# EAGLE design CNY70 (EAGLE 8.1.0)
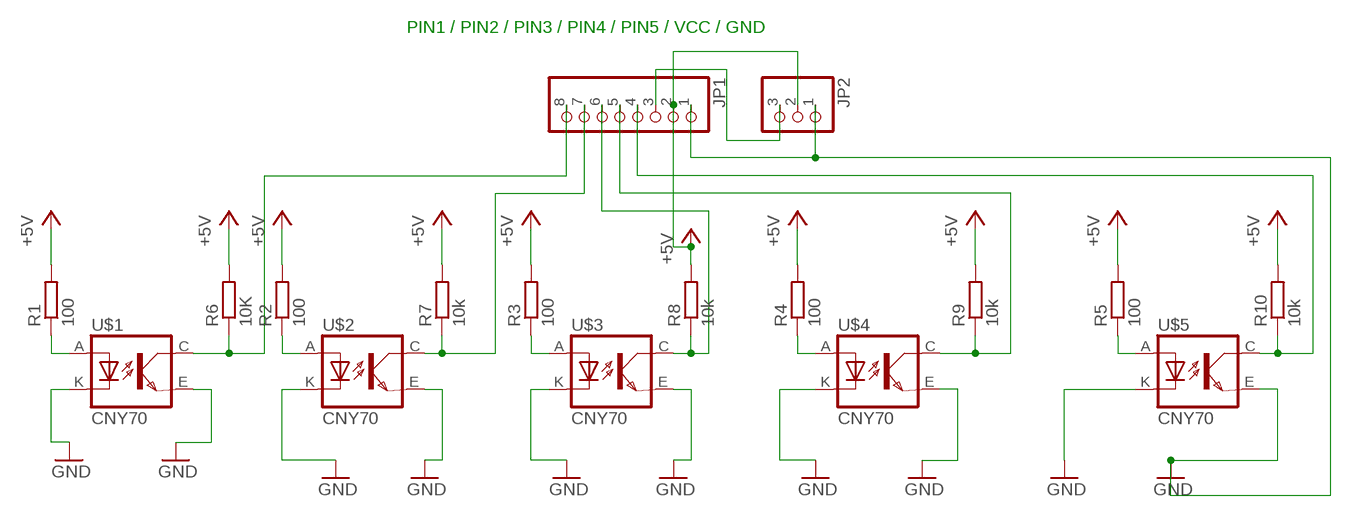
[diagram p0: schematic, sheet 1]

## Parts
JP1  PINHD-1X8  [1X08]
JP2  PINHD-1X3  [1X03]
R1  100  R-EU_0309/12  [0309/12]
R2  100  R-EU_0309/12  [0309/12]
R3  100  R-EU_0309/12  [0309/12]
R4  100  R-EU_0309/12  [0309/12]
R5  100  R-EU_0309/12  [0309/12]
R6  10K  R-EU_0309/12  [0309/12]
R7  10k  R-EU_0309/12  [0309/12]
R8  10k  R-EU_0309/12  [0309/12]
R9  10k  R-EU_0309/12  [0309/12]
R10  10k  R-EU_0309/12  [0309/12]
U$1  CNY70  [4]
U$2  CNY70  [4]
U$3  CNY70  [4]
U$4  CNY70  [4]
U$5  CNY70  [4]

## Nets
+5V: JP1.2 JP2.2 R1.2 R2.2 R3.2 R4.2 R5.2 R6.2 R7.2 R8.2 R9.2 R10.2
GND: JP1.1 JP2.1 U$1.E(EMI) U$1.K(C) U$2.E(EMI) U$2.K(C) U$3.E(EMI) U$3.K(C) U$4.E(EMI) U$4.K(C) U$5.E(EMI) U$5.K(C)
N$1: R1.1 U$1.A
N$2: R2.1 U$2.A
N$3: R3.1 U$3.A
N$4: R4.1 U$4.A
N$5: R5.1 U$5.A
N$6: JP1.8 R6.1 U$1.C(COL)
N$7: JP1.7 R7.1 U$2.C(COL)
N$8: JP1.6 R8.1 U$3.C(COL)
N$9: JP1.3 JP2.3
N$10: JP1.4 R10.1 U$5.C(COL)
N$12: JP1.5 R9.1 U$4.C(COL)

## Notes on the sheet
- PIN1 / PIN2 / PIN3 / PIN4 / PIN5 / VCC / GND

## Library data of the parts
JP1 = pinhead:PINHD-1X8: PIN HEADER
JP2 = pinhead:PINHD-1X3: PIN HEADER
R1-R10 = rcl:R-EU_: RESISTOR, European symbol
U$1-U$5 = cny70:CNY70

## Board
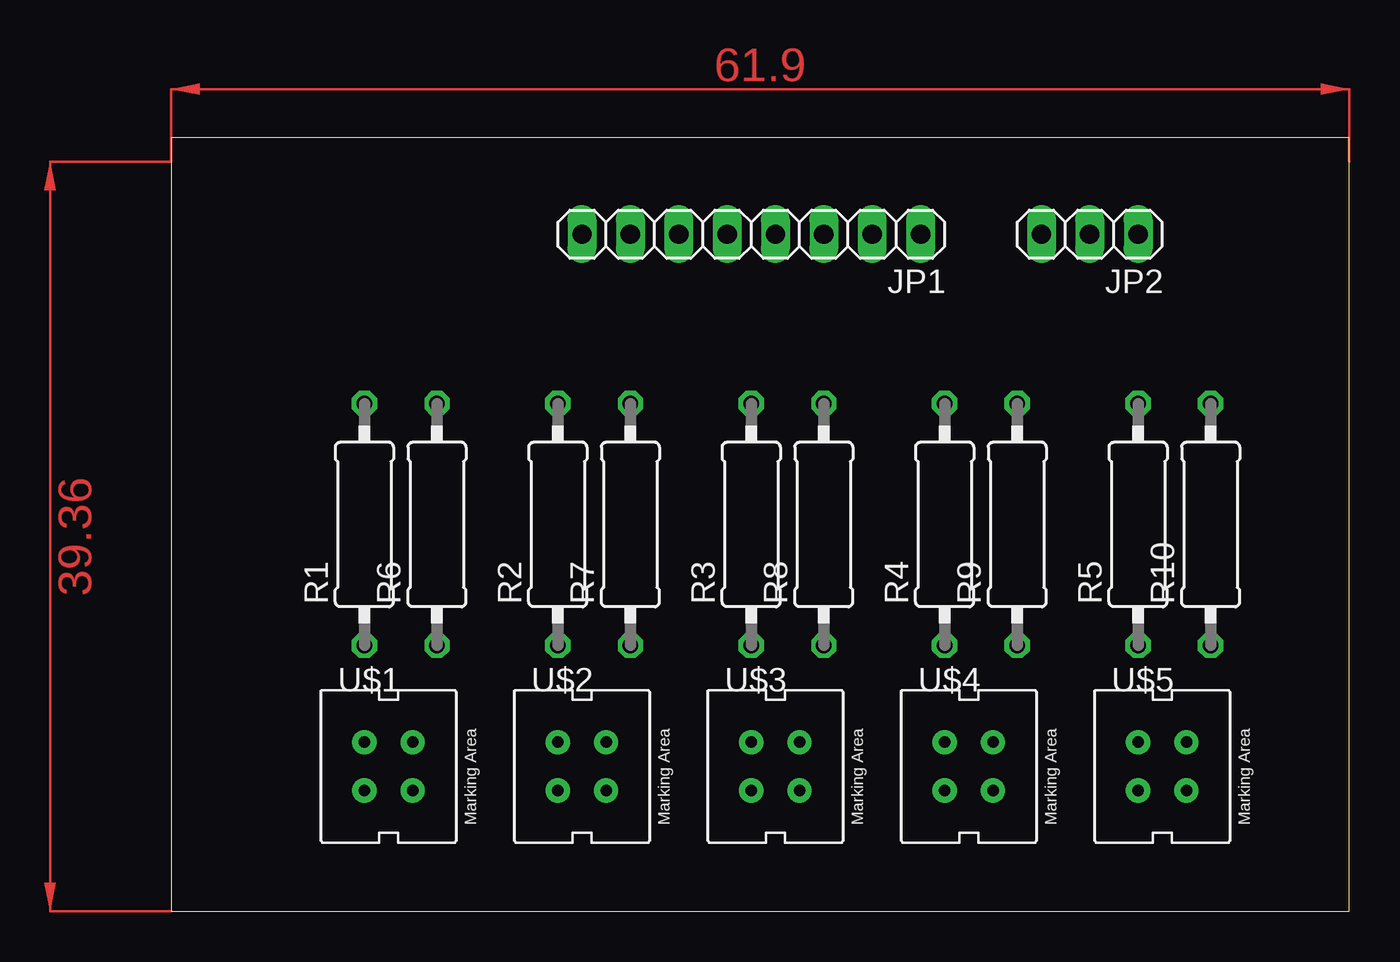
[diagram p1: board, top side]
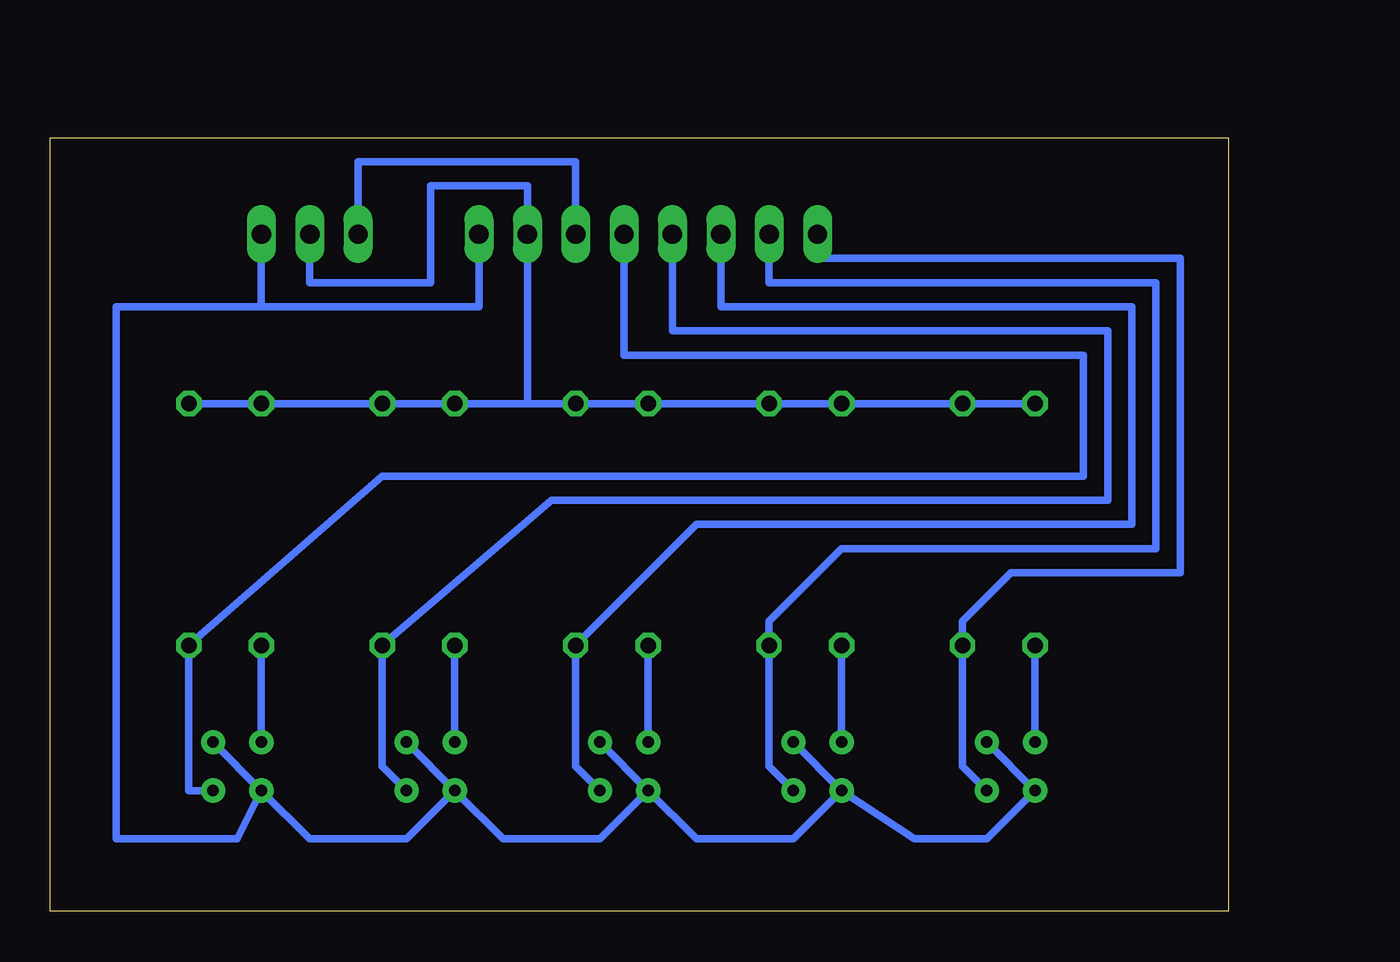
[diagram p2: board, bottom side, seen from below]

Size 61.9 x 40.63 mm. Coordinates in mm from the lower left corner, seen from the top.
Outline: 0,0 61.9,0 61.9,40.63 0,40.63 0,0
Copper layers (1*16): Top 0.035mm / dielectric 1.5mm / Bottom 0.035mm
Design rules "default": minimum track width 10mil, minimum drill 24mil, track to track 8mil, track to pad 8mil, pad to pad 8mil, via to via 8mil, smd to smd 8mil, copper to edge 40mil, drill to drill 8mil, minimum pad ring 10mil, minimum via ring 8mil, stop-mask expansion 4mil, vias tented up to drill 0mil, thermal gap 10mil

### Footprints (pad centres in the part's own frame; a part is rotated, then mirrored left to right if it is on the bottom)
1X08 = drill 1.016 long: 1 -8.89,0; 2 -6.35,0; 3 -3.81,0; 4 -1.27,0; 5 1.27,0; 6 3.81,0; 7 6.35,0; 8 8.89,0
1X03 = drill 1.016 long: 1 -2.54,0; 2 0,0; 3 2.54,0
0309/12 = drill 0.813 octagon: 1 -6.35,0; 2 6.35,0
4 = drill 0.61 pad 1.27: A -1.27,1.27; C 1.27,-1.27; E 1.27,1.27; K -1.27,-1.27

### Placement (x,y rotation side)
JP1  30.48,35.56 180 top
JP2  48.26,35.56 180 top
R1  10.16,20.32 90 top
R2  20.32,20.32 90 top
R3  30.48,20.32 90 top
R4  40.64,20.32 90 top
R5  50.8,20.32 90 top
R6  13.97,20.32 90 top
R7  24.13,20.32 90 top
R8  34.29,20.32 90 top
R9  44.45,20.32 90 top
R10  54.61,20.32 90 top
U$1  11.43,7.62 0 top
U$2  21.59,7.62 0 top
U$3  31.75,7.62 0 top
U$4  41.91,7.62 0 top
U$5  52.07,7.62 0 top

### Tracks (layer width: path | path; a pad name or v marks a point on that pad's centre or on a via)
+5V
  Bottom 0.406: R1.2 R6.2 R2.2 R7.2 R3.2 R8.2 36.83,26.67 | 36.83,26.67 R4.2 R9.2 R5.2 R10.2 | 36.83,26.67 JP1.2 36.83,38.1 41.91,38.1 41.91,33.02 48.26,33.02 JP2.2
GND
  Bottom 0.406: U$1.E U$1.K 12.7,3.81 16.51,3.81 U$2.K | U$2.E U$2.K | U$3.K U$3.E | U$4.K U$4.E | U$5.K U$5.E | U$5.K 52.07,3.81 58.42,3.81 58.42,31.75 50.8,31.75 | U$2.K 22.86,3.81 27.94,3.81 U$3.K | U$4.K 43.18,3.81 48.26,3.81 U$5.K | U$3.K 33.02,3.81 38.1,3.81 U$4.K | JP1.1 39.37,31.75 50.8,31.75 | JP2.1 50.8,31.75
N$1
  Bottom 0.406: U$1.A R1.1
N$2
  Bottom 0.406: R2.1 U$2.A
N$3
  Bottom 0.406: U$3.A R3.1
N$4
  Bottom 0.406: U$4.A R4.1
N$5
  Bottom 0.406: U$5.A R5.1
N$6
  Bottom 0.406: U$1.C 13.97,7.62 R6.1 13.97,15.24 11.43,17.78 2.54,17.78 2.54,34.29 21.59,34.29 JP1.8
N$7
  Bottom 0.406: U$2.C 24.13,7.62 R7.1 24.13,15.24 20.32,19.05 3.81,19.05 3.81,33.02 24.13,33.02 JP1.7
N$8
  Bottom 0.406: U$3.C 34.29,7.62 R8.1 27.94,20.32 5.08,20.32 5.08,31.75 26.67,31.75 JP1.6
N$9
  Bottom 0.406: JP2.3 45.72,39.37 34.29,39.37 JP1.3
N$10
  Bottom 0.406: U$5.C 54.61,6.35 R10.1 44.45,22.86 7.62,22.86 7.62,29.21 31.75,29.21 JP1.4
N$12
  Bottom 0.406: U$4.C 44.45,7.62 R9.1 35.56,21.59 6.35,21.59 6.35,30.48 29.21,30.48 JP1.5
(copper drawn outside any net)
  shapes: Top area x2